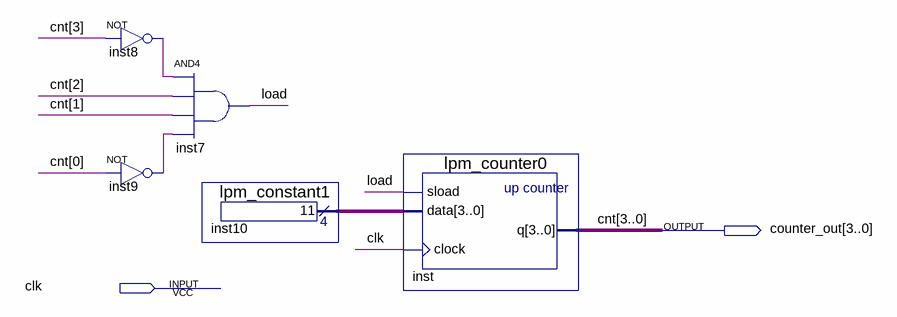
[diagram p0: schematic sheet]
// Quartus schematic lab7_2.bdf as structural Verilog: 5 symbols, 2 pins
module lab7_2 (
  input  clk,
  output [3:0] counter_out
);

  wire inst8_out, inst9_out, load;
  wire [3:0] inst10_result;

  not inst8 (inst8_out, counter_out[3]);
  not inst9 (inst9_out, counter_out[0]);
  and inst7 (load, inst8_out, counter_out[2], counter_out[1], inst9_out);
  lpm_constant1 inst10 (.result(inst10_result));
  lpm_counter0 inst (.sload(load), .data(inst10_result), .clock(clk), .q(counter_out));

  // Other names for the same wires on the sheet: cnt[3:0] = counter_out
endmodule
